# EasyEDA Pro project 小张FOC-STM32G431CBU6.epro, schematic Schematic1_1
Board Name: 主驱一体; Create Date: 2024-09-16; Page Name: P1; Project Name: 小张FOC-STM32G431CBU6; Schematic Name: Schematic1; Update Date: 2024-10-22; Company: 嘉立创EDA; Page Size: A3; Version: V1.0
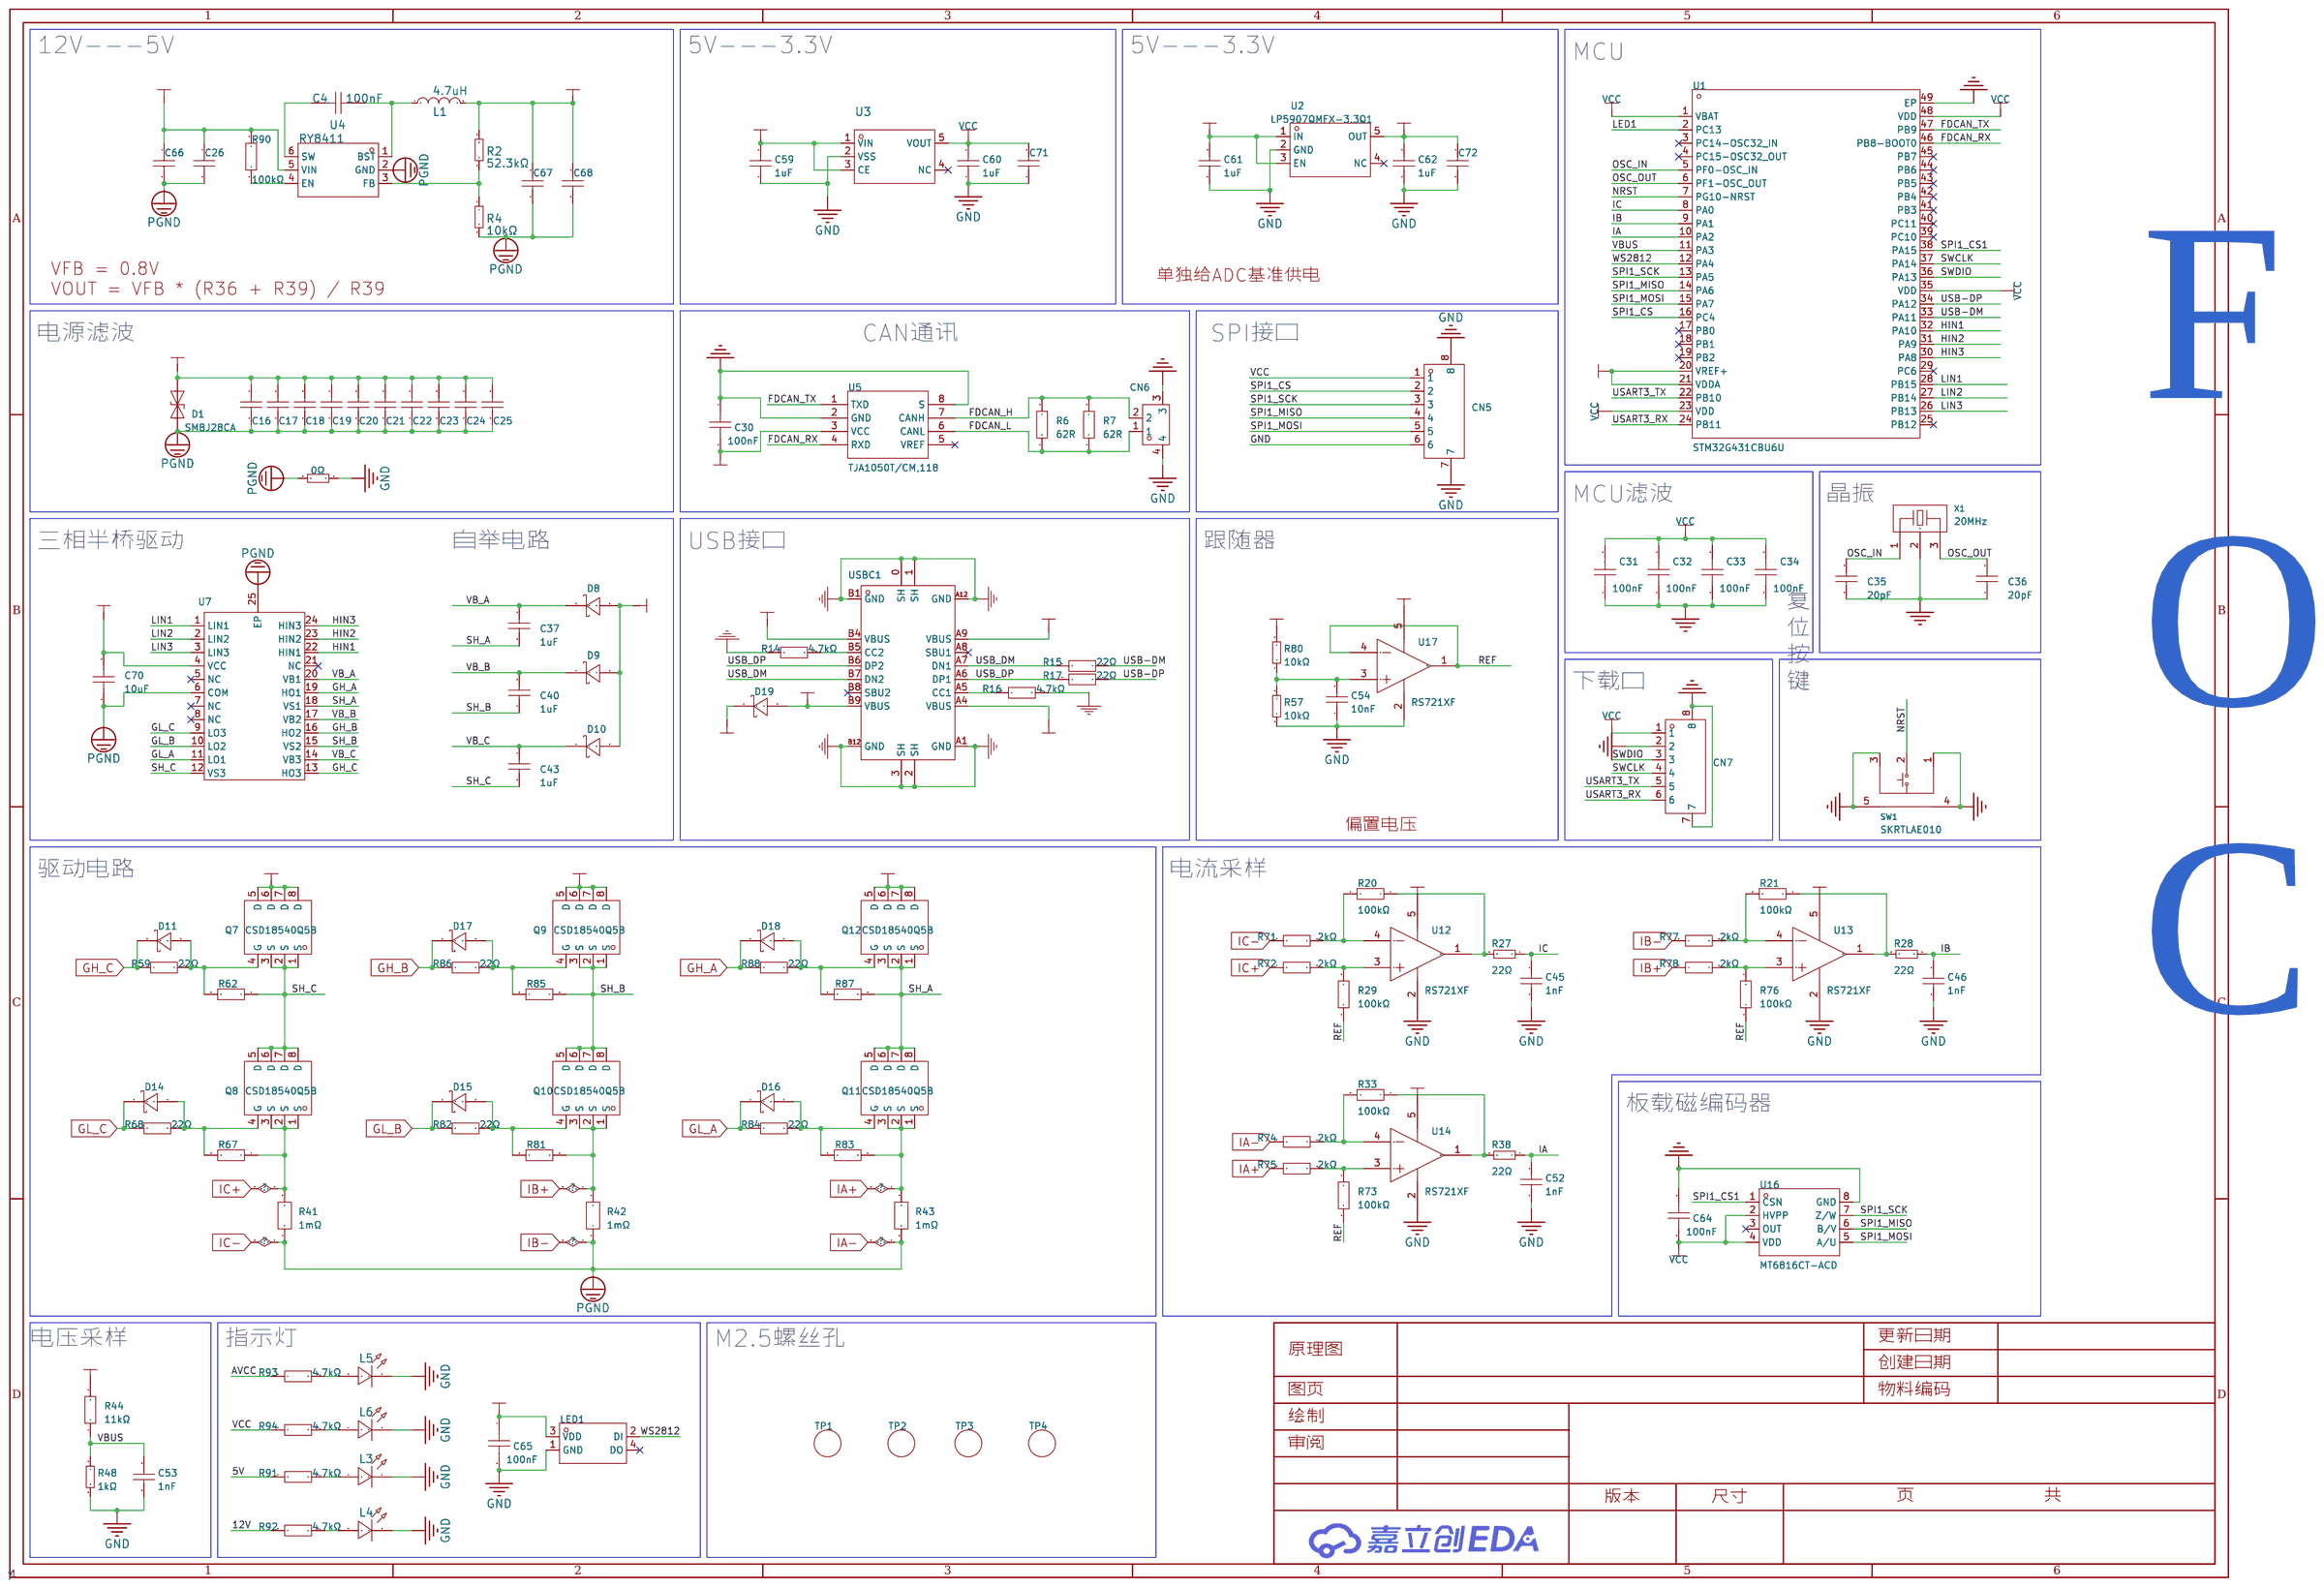
[diagram p2: schematic sheet]

## Parts
C4  100nF  [C0603_SMALL]
C16  10uF  [C1206_SMALL]
C17  10uF  [C1206_SMALL]
C18  10uF  [C1206_SMALL]
C19  10uF  [C1206_SMALL]
C20  10uF  [C1206_SMALL]
C21  10uF  [C1206_SMALL]
C22  10uF  [C1206_SMALL]
C23  10uF  [C1206_SMALL]
C24  10uF  [C1206_SMALL]
C25  10uF  [C1206_SMALL]
C26  100nF  [C0603_SMALL]
C30  100nF  [C0603_SMALL]
C31  100nF  [C0603_SMALL]
C32  100nF  [C0603_SMALL]
C33  100nF  [C0603_SMALL]
C34  100nF  [C0603_SMALL]
C35  20pF  [C0603_SMALL]
C36  20pF  [C0603_SMALL]
C37  1uF  [C0603_SMALL]
C40  1uF  [C0603_SMALL]
C43  1uF  [C0603_SMALL]
C45  1nF  [C0603_SMALL]
C46  1nF  [C0603_SMALL]
C52  1nF  [C0603_SMALL]
C53  1nF  [C0603_SMALL]
C54  10nF  [C0603_SMALL]
C59  1uF  [C0603_SMALL]
C60  1uF  [C0603_SMALL]
C61  1uF  [C0603_SMALL]
C62  1uF  [C0603_SMALL]
C64  100nF  [C0603_SMALL]
C65  100nF  [C0603_SMALL]
C66  10uF  [C1206_SMALL]
C67  10uF  [C1206_SMALL]
C68  100nF  [C0603_SMALL]
C70  10uF  [C0805_SMALL]
C71  100nF  [C0603_SMALL]
C72  100nF  [C0603_SMALL]
CN5  WAFER-GH1.25-6PWB  [CONN-SMD_6P-P1.25_XUNPU_WAFER-GH1.25-6PWB]
CN6  X1251WRS-02HF-LPSW  [CONN-SMD_2P-P1.25_X1251WRS-02HF-LPSW]
CN7  WAFER-GH1.25-6PWB  [CONN-SMD_6P-P1.25_XUNPU_WAFER-GH1.25-6PWB]
D1  SMBJ28CA  [SMB_L4.6-W3.6-LS5.3-BI]
D8  B16WS  [SOD-323_L1.8-W1.3-LS2.5-RD]
D9  B16WS  [SOD-323_L1.8-W1.3-LS2.5-RD]
D10  B16WS  [SOD-323_L1.8-W1.3-LS2.5-RD]
D11  B16WS  [SOD-323_L1.8-W1.3-LS2.5-RD]
D14  B16WS  [SOD-323_L1.8-W1.3-LS2.5-RD]
D15  B16WS  [SOD-323_L1.8-W1.3-LS2.5-RD]
D16  B16WS  [SOD-323_L1.8-W1.3-LS2.5-RD]
D17  B16WS  [SOD-323_L1.8-W1.3-LS2.5-RD]
D18  B16WS  [SOD-323_L1.8-W1.3-LS2.5-RD]
D19  B16WS  [SOD-323_L1.8-W1.3-LS2.5-RD]
L1  4.7uH  [IND-SMD_L2.5-W2.0]
L3  NCD0603R1  [LED0603_S]
L4  NCD0603R1  [LED0603_S]
L5  NCD0603R1  [LED0603_S]
L6  NCD0603R1  [LED0603_S]
LED1  XL-3528RGBW-WS2812B  [LED-SMD_4P-L3.5-W2.8-BR-1]
Q7  CSD18540Q5B  [VSON-CLIP-8_L5.0-W6.0-P1.27-BL]
Q8  CSD18540Q5B  [VSON-CLIP-8_L5.0-W6.0-P1.27-BL]
Q9  CSD18540Q5B  [VSON-CLIP-8_L5.0-W6.0-P1.27-BL]
Q10  CSD18540Q5B  [VSON-CLIP-8_L5.0-W6.0-P1.27-BL]
Q11  CSD18540Q5B  [VSON-CLIP-8_L5.0-W6.0-P1.27-BL]
Q12  CSD18540Q5B  [VSON-CLIP-8_L5.0-W6.0-P1.27-BL]
R2  52.3kΩ  [R0603_SMALL]
R4  10kΩ  [R0603_SMALL]
R6  62R  [R0603_SMALL]
R7  62R  [R0603_SMALL]
R11  0Ω  [R0603_SMALL]
R14  4.7kΩ  [R0603_SMALL]
R15  22Ω  [R0603_SMALL]
R16  4.7kΩ  [R0603_SMALL]
R17  22Ω  [R0603_SMALL]
R20  100kΩ  [R0603_SMALL]
R21  100kΩ  [R0603_SMALL]
R27  22Ω  [R0603_SMALL]
R28  22Ω  [R0603_SMALL]
R29  100kΩ  [R0603_SMALL]
R33  100kΩ  [R0603_SMALL]
R38  22Ω  [R0603_SMALL]
R41  1mΩ  [RES-SMD_L6.4-W3.2_LR2512D-3W-1MR]
R42  1mΩ  [RES-SMD_L6.4-W3.2_LR2512D-3W-1MR]
R43  1mΩ  [RES-SMD_L6.4-W3.2_LR2512D-3W-1MR]
R44  11kΩ  [R0603_SMALL]
R48  1kΩ  [R0603_SMALL]
R57  10kΩ  [R0603_SMALL]
R59  22Ω  [R0603_SMALL]
R62  10kΩ  [R0603_SMALL]
R67  10kΩ  [R0603_SMALL]
R68  22Ω  [R0603_SMALL]
R71  2kΩ  [R0603_SMALL]
R72  2kΩ  [R0603_SMALL]
R73  100kΩ  [R0603_SMALL]
R74  2kΩ  [R0603_SMALL]
R75  2kΩ  [R0603_SMALL]
R76  100kΩ  [R0603_SMALL]
R77  2kΩ  [R0603_SMALL]
R78  2kΩ  [R0603_SMALL]
R80  10kΩ  [R0603_SMALL]
R81  10kΩ  [R0603_SMALL]
R82  22Ω  [R0603_SMALL]
R83  10kΩ  [R0603_SMALL]
R84  22Ω  [R0603_SMALL]
R85  10kΩ  [R0603_SMALL]
R86  22Ω  [R0603_SMALL]
R87  10kΩ  [R0603_SMALL]
R88  22Ω  [R0603_SMALL]
R90  100kΩ  [R0603_SMALL]
R91  4.7kΩ  [R0603_SMALL]
R92  4.7kΩ  [R0603_SMALL]
R93  4.7kΩ  [R0603_SMALL]
R94  4.7kΩ  [R0603_SMALL]
SW1  SKRTLAE010  [KEY-SMD_SKRTLAE010]
TP1  -  [M2.5螺丝孔]
TP2  -  [M2.5螺丝孔]
TP3  -  [M2.5螺丝孔]
TP4  -  [M2.5螺丝孔]
U1  STM32G431CBU6U  [UFQFPN-48_L7.0-W7.0-P0.50-BL-EP5.6]
U2  LP5907QMFX-3.3Q1  [SOT-23-5_L3.0-W1.7-P0.95-LS2.8-BR]
U3  XC6210B332MR  [SOT-23-5_L3.0-W1.7-P0.95-LS2.8-BR]
U4  RY8411  [SOT-23-6_L2.9-W1.6-P0.95-LS2.8-BR]
U5  TJA1050T/CM,118  [SOIC-8_L5.0-W4.0-P1.27-LS6.0-BL]
U7  FD6288Q  [QFN-24_L4.0-W4.0-P0.50-BL-EP2.6]
U12  RS721XF  [TSOT-23-5_L2.9-W1.6-P0.95-LS2.8-BL]
U13  RS721XF  [TSOT-23-5_L2.9-W1.6-P0.95-LS2.8-BL]
U14  RS721XF  [TSOT-23-5_L2.9-W1.6-P0.95-LS2.8-BL]
U16  MT6816CT-ACD  [SOP-8_L5.0-W4.0-P1.27-LS6.0-BL]
U17  RS721XF  [TSOT-23-5_L2.9-W1.6-P0.95-LS2.8-BL]
USBC1  TYPE-C-31-M-12  [USB-C_SMD-TYPE-C-31-M-12]
X1  20MHz  [OSC-SMD_3P-L3.2-W1.3-P1.2-L]

## Library data of the parts
C4 = CC0603KRX7R9BB104: 容值:100nF;精度:±10%;额定电压:50V;材质(温度系数):X7R;; LCSC Part Name: 100nF ±10% 50V; Supplier Part: C14663; Manufacturer: YAGEO(国巨); Supplier Footprint: 0603; JLCPCB Part Class: 基础库; Datasheet: https://atta.szlcsc.com/upload/public/pdf/source/20180910/C282072_33301C7F631E79921B82A8DAC6BCC5B3.pdf; Supplier: LCSC; Tolerance: ±10%; Voltage Rated: 50V; Temperature Coefficient: X7R; Check: true
C16-C25 C66 C67 = CL31A106KBHNNNE: 容值:10uF;精度:±10%;额定电压:50V;材质(温度系数):X5R;; LCSC Part Name: 10uF ±10% 50V; Supplier Part: C13585; Manufacturer: SAMSUNG(三星); Supplier Footprint: 1206; JLCPCB Part Class: Basic Part; Datasheet: https://atta.szlcsc.com/upload/public/pdf/source/20160218/1457707763339.pdf; Supplier: LCSC; Tolerance: ±10%; Voltage Rated: 50V; Temperature Coefficient: X5R; Pin Type: IN; 值: 10UF; Check: true
C26 C68 C71 C72 = 0603B104K500NT: 容值:100nF;精度:±10%;额定电压:50V;材质(温度系数):X7R;; LCSC Part Name: 100nF ±10% 50V; Supplier Part: C30926; Manufacturer: FH(风华); Supplier Footprint: 0603; JLCPCB Part Class: Extended Part; Datasheet: https://atta.szlcsc.com/upload/public/pdf/source/20200305/C486355_26A10D38EF8C2A5C37091D0039909270.pdf; Supplier: LCSC; Tolerance: ±10%; Voltage Rated: 50V; Temperature Coefficient: X7R; Pin Type: IN; Check: true
C30-C34 C64 C65 = 0603B104K500NT: 容值:100nF;精度:±10%;额定电压:50V;材质(温度系数):X7R;; LCSC Part Name: 100nF ±10% 50V; Supplier Part: C30926; Manufacturer: FH(风华); Supplier Footprint: 0603; JLCPCB Part Class: Extended Part; Datasheet: https://atta.szlcsc.com/upload/public/pdf/source/20200305/C486355_26A10D38EF8C2A5C37091D0039909270.pdf; Supplier: LCSC; Tolerance: ±10%; Voltage Rated: 50V; Temperature Coefficient: X7R
C35 C36 = 20pF: LCSC Part Name: 20pF±5%50V; Supplier Part: C1648; Manufacturer: SAMSUNG(三星); Manufacturer Part: CL10C200JB8NNNC; Supplier Footprint: 0603; JLCPCB Part Class: 基础库; Datasheet: https://atta.szlcsc.com/upload/public/pdf/source/20160103/1457707686863.pdf; Supplier: LCSC; Tolerance: ±5%; Voltage Rated: 50V; Temperature Coefficient: C0G; Origin Footprint 2: C0603; Origin Footprint 1: CL10C200JB8NNNC
C37 C40 C43 = C0603_S: Pin Type: IN; Supplier Part: C1604; Check: true
C45 C46 C52 C53 = 0603B102K500NT: 容值:1nF;精度:±10%;额定电压:50V;材质(温度系数):X7R;; LCSC Part Name: 1nF ±10% 50V; Supplier Part: C44369; Manufacturer: FH(风华); Supplier Footprint: 0603; JLCPCB Part Class: Extended Part; Datasheet: https://atta.szlcsc.com/upload/public/pdf/source/20200305/C486355_26A10D38EF8C2A5C37091D0039909270.pdf; Supplier: LCSC; Tolerance: ±10%; Voltage Rated: 50V; Temperature Coefficient: X7R; Pin Type: IN; Check: true
C54 = 0603B103K500NT: 容值:10nF;精度:±10%;额定电压:50V;材质(温度系数):X7R;; LCSC Part Name: 10nF ±10% 50V; Supplier Part: C57112; Manufacturer: FH(风华); Supplier Footprint: 0603; JLCPCB Part Class: 基础库; Datasheet: https://atta.szlcsc.com/upload/public/pdf/source/20200305/C486355_26A10D38EF8C2A5C37091D0039909270.pdf; Supplier: LCSC; Tolerance: ±10%; Voltage Rated: 50V; Temperature Coefficient: X7R; Pin Type: IN; Check: true
C59-C62 = CL10A106MA8NRNC: 容值:10uF;精度:±20%;额定电压:25V;材质(温度系数):X5R;; LCSC Part Name: 10uF ±20% 25V; Supplier Part: C96446; Manufacturer: SAMSUNG(三星); Supplier Footprint: 0603; JLCPCB Part Class: 基础库; Datasheet: https://atta.szlcsc.com/upload/public/pdf/source/20160218/1457707763339.pdf; Supplier: LCSC; Tolerance: ±20%; Voltage Rated: 25V; Temperature Coefficient: X5R; Pin Type: IN; Check: true
C70 = CL21A106KAYNNNE_C15850: 容值:10uF;精度:±10%;额定电压:25V;材质(温度系数):X5R;; LCSC Part Name: 10uF ±10% 25V; Supplier Part: C15850; Manufacturer: SAMSUNG(三星); Manufacturer Part: CL21A106KAYNNNE; Supplier Footprint: 0805; JLCPCB Part Class: Basic Part; Datasheet: https://atta.szlcsc.com/upload/public/pdf/source/20160103/1457707679302.pdf; Supplier: LCSC; Tolerance: ±10%; Voltage Rated: 25V; Temperature Coefficient: X5R
CN5 CN7 = WAFER-GH1.25-6PWB: 参考系列:GH;间距:1.25mm;插针结构:1x6P;排数:1;每排PIN数:6;公母:公型插针;安装方式:卧贴;额定电流:1A;工作温度范围:-25~+85;; LCSC Part Name: GH1.25mm6P卧贴带扣带扣; Supplier Part: C3029381; Manufacturer: XUNPU(讯普); Supplier Footprint: SMD,P=1.25mm; JLCPCB Part Class: ExtendedPart; Datasheet: https://atta.szlcsc.com/upload/public/pdf/source/20220527/CB8773BFB0913C3B8ABD62CB38BA101A.pdf; Supplier: LCSC; Reference Series: GH; Pitch: 1.25mm; Pins Structure: 1x6P; Number of Rows: 1; Number of PINs Per Row: 6; Gender: 公型插针; Mounting Style: 卧贴; Current Rating (Max): 1A; Operating Temperature Range: -25~+85; Check: true
CN6 = X1251WRS-02HF-LPSW: 插针结构:1x2P;间距:1.25mm;安装方式:卧贴;参考系列:GH;总PIN数:2P;排数:1;每排PIN数:2;行距:-;额定电流:1A;触头材质:黄铜;触头镀层:锡;工作温度范围:-;; LCSC Part Name: 1x2P 间距:1.25mm 卧贴 系列:GH; Supplier Part: C388707; Manufacturer: XKB Connection(中国星坤); Supplier Footprint: SMD,P=1.25mm,卧贴; JLCPCB Part Class: 扩展库; Datasheet: https://atta.szlcsc.com/upload/public/pdf/source/20211011/E2F7306AE87519079AD4EC816349A567.pdf; Supplier: LCSC; Pins Structure: 1x2P; Pitch: 1.25mm; Mounting Style: 卧贴; Reference Series: GH; Number of Pins: 2P; Number of Rows: 1; Number of PINs Per Row: 2; Current Rating (Max): 1A; Contact Material: 黄铜; Contact Plating: 锡
D1 = SMBJ28CA: 反向截止电压(Vrwm):28V;最大钳位电压:45.4V;峰值脉冲电流(Ipp)@10/1000us:13.2A;击穿电压:31.1V;; Supplier Part: C356756; Manufacturer: JJW(捷捷微); Supplier Footprint: SMB(DO-214AA); JLCPCB Part Class: 扩展库; Datasheet: https://atta.szlcsc.com/upload/public/pdf/source/20190118/C364661_581AFCFF6ECC065E7F89B606E0837F4E.pdf; Supplier: LCSC; Reverse Stand-Off Voltage (Vrwm): 28V; Maximum Clamping Voltage: 45.4V; Peak Pulse Current (Ipp)@10/1000us: 13.2A; Breakdown Voltage: 31.1V; Reverse Leakage Current (Ir): 1uA; Type: TVS
D8-D10 = B16WS_C364278: 直流反向耐压(Vr):40V;平均整流电流(Io):1A;正向压降(Vf):650mV@1A;; Supplier Part: C364278; Manufacturer: MDD; Supplier Footprint: SOD-323; JLCPCB Part Class: Extended Part; Datasheet: https://atta.szlcsc.com/upload/public/pdf/source/20190125/C364278_08C9E980565605CB111C36D3361AA1D7.pdf; Supplier: LCSC; Reverse Voltage (Vr): 40V; Average Rectified Current (Io): 1A; Forward Voltage (Vf@If): 650mV@1A; Check: true
D11 D14-D19 = B16WS_C364278: 直流反向耐压(Vr):60V;平均整流电流(Io):1A;正向压降(Vf):700mV@1A;; Supplier Part: C364278; Manufacturer: MDD; Supplier Footprint: SOD-323; JLCPCB Part Class: Extended Part; Datasheet: https://atta.szlcsc.com/upload/public/pdf/source/20190125/C364278_08C9E980565605CB111C36D3361AA1D7.pdf; Supplier: LCSC; Reverse Voltage (Vr): 60V; Average Rectified Current (Io): 1A; Forward Voltage (Vf@If): 700mV@1A; Check: true
L1 = MPIH252010-4R7M-LF: 电感值:4.7uH;精度:±20%;额定电流:1A;; LCSC Part Name: 4.7uH ±20% 1A 275mΩ; Supplier Part: C490449; Manufacturer: microgate(麦捷科技); Supplier Footprint: SMD; JLCPCB Part Class: Extended Part; Datasheet: https://atta.szlcsc.com/upload/public/pdf/source/20200707/C490443_2060EC88E48E101AE91DC68C352BCAF4.pdf; Supplier: LCSC; Tolerance: ±20%; Rated Current: 1A; DC Resistance (DCR): 275mΩ; Check: true
L3-L6 = NCD0603R1_C84263: 发光颜色:红色;功率:65mW;透镜颜色:无色透明;主波长:615nm~630nm;发光强度:80mcd~220mcd;发光角度:130°;工作温度:-30℃~+85℃;; LCSC Part Name: 红灯 0603红灯   正贴; Supplier Part: C84263; Manufacturer: 国星光电; Supplier Footprint: 0603; JLCPCB Part Class: Extended Part; Datasheet: https://atta.szlcsc.com/upload/public/pdf/source/20200820/C84263_DABC6A75E58F576973B407FDBA283D60.pdf; Supplier: LCSC; Emitted Color: 红色; Forward Voltage (VF): 1.6V~2.6V; Forward Current: 20mA; Power Dissipation: 65mW; Lens Color: 无色透明; Dominant Wavelength: 615nm~630nm; Luminous Intensity: 80mcd~220mcd; Viewing Angle: 130°; Operating Temperature: -30℃~+85℃; Check: true
LED1 = XL-3528RGBW-WS2812B: 发光颜色:RGB三色;二极管配置:-;主波长:618nm~623nm；520nm~525nm；467nm~472nm;功率:50mW；50mW；45mW;安装方式:正贴;; LCSC Part Name: RGB三色 正贴 幻彩; Supplier Part: C2890364; Manufacturer: XINGLIGHT(成兴光); Supplier Footprint: SMD3528-4P; JLCPCB Part Class: 扩展库; Datasheet: https://atta.szlcsc.com/upload/public/pdf/source/20221102/50F456983F591359B0D81AA557777463.pdf; Supplier: LCSC; Emitted Color: RGB三色; Dominant Wavelength: 618nm~623nm；520nm~525nm；467nm~472nm; Peak Wavelength: 525nm；623nm；472nm; Forward Current: 20mA; Power Dissipation: 50mW；50mW；45mW; Viewing Angle: 120°; Mounting Sytle: 正贴; Operating Temperature: -25℃~+80℃; Check: true
Q7-Q12 = CSD18540Q5B: 类型:1个N沟道;漏源电压(Vdss):60V;连续漏极电流(Id):100A;功率(Pd):3.1W；195W;导通电阻(RDS(on)@Vgs,Id):2.2mΩ@10V,28A;阈值电压(Vgs(th)@Id):2.3V@250uA;; LCSC Part Name: 1个N沟道 耐压:60V 电流:100A; Supplier Part: C86513; Manufacturer: TI(德州仪器); Supplier Footprint: VSON-8(5x6); JLCPCB Part Class: 扩展库; Datasheet: https://www.ti.com/cn/lit/gpn/csd18540q5b; Supplier: LCSC; Type: 1个N沟道; Drain Source Voltage (Vdss): 60V; Continuous Drain Current (Id): 100A; Power Dissipation (Pd): 3.1W；195W; Drain Source On Resistance (RDS(on)@Vgs,Id): 2.2mΩ@10V,28A; Gate Threshold Voltage (Vgs(th)@Id): 2.3V@250uA; Total Gate Charge (Qg@Vgs): 53nC@10V; Input Capacitance (Ciss@Vds): 4.23nF@30V; Operating Temperature: -55℃~+150℃@(Tj)
R2 = 0603WAF6202T5E: 阻值:62kΩ;精度:±1%;功率:100mW;温度系数:±100ppm/℃;电阻类型:厚膜电阻;; LCSC Part Name: 62kΩ ±1% 100mW 厚膜电阻; Supplier Part: C23221; Manufacturer: UNI-ROYAL(厚声); Supplier Footprint: 0603; JLCPCB Part Class: Basic Part; Datasheet: https://atta.szlcsc.com/upload/public/pdf/source/20200306/C422600_1E6D84923E4A46A82E41ADD87F860B5C.pdf; Supplier: LCSC; Tolerance: ±1%; Power(Watts): 100mW; Overload Voltage (Max): 75V; Temperature Coefficient: ±100ppm/℃; Type: 厚膜电阻; Operating Temperature Range: -55℃~+155℃; Pin Type: IN; 美岩编码: A00010; 单价: 0.009222; Check: true
R4 = 0603WAF1202T5E: 阻值:12kΩ;精度:±1%;功率:100mW;温度系数:±100ppm/℃;电阻类型:厚膜电阻;; LCSC Part Name: 12kΩ ±1% 100mW 厚膜电阻; Supplier Part: C22790; Manufacturer: UNI-ROYAL(厚声); Supplier Footprint: 0603; JLCPCB Part Class: Basic Part; Datasheet: https://atta.szlcsc.com/upload/public/pdf/source/20200306/C422600_1E6D84923E4A46A82E41ADD87F860B5C.pdf; Supplier: LCSC; Tolerance: ±1%; Power(Watts): 100mW; Overload Voltage (Max): 75V; Temperature Coefficient: ±100ppm/℃; Type: 厚膜电阻; Operating Temperature Range: -55℃~+155℃; Pin Type: IN; 美岩编码: A00010; 单价: 0.009222; Check: true
R6 R7 = Res_0603: Supplier Footprint: 0603
R11 = RS-03000FT: 阻值:0Ω;精度:±1%;功率:100mW;; LCSC Part Name: 0Ω ±1% 100mW; Supplier Part: C136582; Manufacturer: FH(风华); Supplier Footprint: 0603; JLCPCB Part Class: Extended Part; Datasheet: https://atta.szlcsc.com/upload/public/pdf/source/20171106/C136582_15099532019501092527.pdf; Supplier: LCSC; Tolerance: ±1%; Power(Watts): 100mW; Overload Voltage (Max): 50V; Operating Temperature Range: -55℃~+155℃; Pin Type: IN; Check: true
R14 R16 R91-R94 = 0603WAF4701T5E: 电阻类型:厚膜电阻;阻值:4.7kΩ;精度:±1%;功率:100mW;最大工作电压:75V;温度系数:±100ppm/℃;; LCSC Part Name: 4.7kΩ ±1% 100mW 厚膜电阻; Supplier Part: C23162; Manufacturer: UNI-ROYAL(厚声); Supplier Footprint: 0603; JLCPCB Part Class: 基础库; Datasheet: https://atta.szlcsc.com/upload/public/pdf/source/20200306/C422600_1E6D84923E4A46A82E41ADD87F860B5C.pdf; Supplier: LCSC; Type: 厚膜电阻; Tolerance: ±1%; Power(Watts): 100mW; Overload Voltage (Max): 75V; Temperature Coefficient: ±100ppm/℃; Operating Temperature Range: -55℃~+155℃
R15 R17 = 0603WAF220JT5E: 电阻类型:厚膜电阻;阻值:22Ω;精度:±1%;功率:100mW;最大工作电压:75V;温度系数:±100ppm/℃;; LCSC Part Name: 22Ω ±1% 100mW 厚膜电阻; Supplier Part: C23345; Manufacturer: UNI-ROYAL(厚声); Supplier Footprint: 0603; JLCPCB Part Class: 基础库; Datasheet: https://atta.szlcsc.com/upload/public/pdf/source/20200306/C422600_1E6D84923E4A46A82E41ADD87F860B5C.pdf; Supplier: LCSC; Type: 厚膜电阻; Tolerance: ±1%; Power(Watts): 100mW; Overload Voltage (Max): 75V; Temperature Coefficient: ±100ppm/℃; Operating Temperature Range: -55℃~+155℃
R20 R21 R29 R33 R73 R76 R90 = 0603WAF1003T5E: 电阻类型:厚膜电阻;阻值:100kΩ;精度:±1%;功率:100mW;最大工作电压:75V;温度系数:±100ppm/℃;; LCSC Part Name: 100kΩ ±1% 100mW 厚膜电阻; Supplier Part: C25803; Manufacturer: UNI-ROYAL(厚声); Supplier Footprint: 0603; JLCPCB Part Class: 基础库; Datasheet: https://atta.szlcsc.com/upload/public/pdf/source/20200306/C422600_1E6D84923E4A46A82E41ADD87F860B5C.pdf; Supplier: LCSC; Type: 厚膜电阻; Tolerance: ±1%; Power(Watts): 100mW; Overload Voltage (Max): 75V; Temperature Coefficient: ±100ppm/℃; Operating Temperature Range: -55℃~+155℃
R27 R28 R38 R59 R68 R82 R84 R86 R88 = 0603WAF220JT5E: 电阻类型:厚膜电阻;阻值:22Ω;精度:±1%;功率:100mW;最大工作电压:75V;温度系数:±100ppm/℃;; LCSC Part Name: 22Ω ±1% 100mW 厚膜电阻; Supplier Part: C23345; Manufacturer: UNI-ROYAL(厚声); Supplier Footprint: 0603; JLCPCB Part Class: 基础库; Datasheet: https://atta.szlcsc.com/upload/public/pdf/source/20200306/C422600_1E6D84923E4A46A82E41ADD87F860B5C.pdf; Supplier: LCSC; Type: 厚膜电阻; Tolerance: ±1%; Power(Watts): 100mW; Overload Voltage (Max): 75V; Temperature Coefficient: ±100ppm/℃; Operating Temperature Range: -55℃~+155℃; Pin Type: IN; Check: true
R41-R43 = LR2512D-3W-1mR-1%: 电阻类型:采样电阻;阻值:1mΩ;精度:±1%;功率:3W;温度系数:25ppm/℃~+50ppm/℃;安装方式:贴片;; LCSC Part Name: 1mΩ ±1% 3W; Supplier Part: C500734; Manufacturer: Milliohm(毫欧); Supplier Footprint: 2512; JLCPCB Part Class: 扩展库; Datasheet: https://atta.szlcsc.com/upload/public/pdf/source/20211008/27BCB003066C6550DC06C87D8395239C.pdf; Supplier: LCSC; Type: 采样电阻; Tolerance: ±1%; Power(Watts): 3W; Temperature Coefficient: 25ppm/℃~+50ppm/℃; Mounting Sytle: 贴片
R44 = RC0603FR-0711KL: 电阻类型:厚膜电阻;阻值:11kΩ;精度:±1%;功率:100mW;最大工作电压:75V;温度系数:±100ppm/℃;; LCSC Part Name: 厚膜电阻 11kΩ ±1% 100mW; Supplier Part: C137801; Manufacturer: YAGEO(国巨); Supplier Footprint: 0603; JLCPCB Part Class: 扩展库; Datasheet: https://atta.szlcsc.com/upload/public/pdf/source/20180821/C275644_0D56F95EFF785E7D9A1FEF436B37DA78.pdf; Supplier: LCSC; Type: 厚膜电阻; Tolerance: ±1%; Power(Watts): 100mW; Overload Voltage (Max): 75V; Temperature Coefficient: ±100ppm/℃; Operating Temperature Range: -55℃~+155℃
R48 = RC0603FR-071KL: 电阻类型:厚膜电阻;阻值:1kΩ;精度:±1%;功率:100mW;; LCSC Part Name: 1kΩ ±1% 100mW; Supplier Part: C22548; Manufacturer: YAGEO(国巨); Supplier Footprint: 0603; JLCPCB Part Class: Extended Part; Datasheet: https://atta.szlcsc.com/upload/public/pdf/source/20180312/7BD3618A8B6324EA6280B0497A051AB7.pdf; Supplier: LCSC; Type: 厚膜电阻; Tolerance: ±1%; Power(Watts): 100mW; Temperature Coefficient: ±100ppm/℃; Overload Voltage (Max): 75V; Operating Temperature Range: -55℃~+155℃; Pin Type: IN; Check: true
R57 R62 R67 R80 R81 R83 R85 R87 = 0603WAF1002T5E: 阻值:10kΩ;精度:±1%;功率:100mW;温度系数:±100ppm/℃;电阻类型:厚膜电阻;; LCSC Part Name: 10kΩ ±1% 100mW 厚膜电阻; Supplier Part: C25804; Manufacturer: UNI-ROYAL(厚声); Supplier Footprint: 0603; JLCPCB Part Class: Basic Part; Datasheet: https://atta.szlcsc.com/upload/public/pdf/source/20200306/C422600_1E6D84923E4A46A82E41ADD87F860B5C.pdf; Supplier: LCSC; Tolerance: ±1%; Power(Watts): 100mW; Overload Voltage (Max): 75V; Temperature Coefficient: ±100ppm/℃; Type: 厚膜电阻; Operating Temperature Range: -55℃~+155℃; Pin Type: IN; Check: true
R71 R72 R74 R75 R77 R78 = 0603WAF3301T5E: 电阻类型:厚膜电阻;阻值:3.3kΩ;精度:±1%;功率:100mW;最大工作电压:75V;温度系数:±100ppm/℃;; LCSC Part Name: 3.3kΩ ±1% 100mW 厚膜电阻; Supplier Part: C22978; Manufacturer: UNI-ROYAL(厚声); Supplier Footprint: 0603; JLCPCB Part Class: 基础库; Datasheet: https://atta.szlcsc.com/upload/public/pdf/source/20200306/C422600_1E6D84923E4A46A82E41ADD87F860B5C.pdf; Supplier: LCSC; Type: 厚膜电阻; Tolerance: ±1%; Power(Watts): 100mW; Overload Voltage (Max): 75V; Temperature Coefficient: ±100ppm/℃; Operating Temperature Range: -55℃~+155℃
SW1 = SKRTLAE010: 电路结构:单刀单掷;按钮形状:圆形按钮;安装方式:卧贴;开关长度:4.5mm;开关宽度:3.4mm;开关高度:3.3mm;触点电流:50mA;额定电压(DC):12V;带灯:-;机械寿命:-;; LCSC Part Name: 4.5*3.4*3.3mm 卧贴 轻触开关; Supplier Part: C110293; Manufacturer: ALPSALPINE(阿尔卑斯阿尔派); Supplier Footprint: SMD; JLCPCB Part Class: 扩展库; Datasheet: https://atta.szlcsc.com/upload/public/pdf/source/20170428/1493376812809.pdf; Supplier: LCSC; Circuit: 单刀单掷; Actuator Style: 圆形按钮; Mounting Style: 卧贴; Switch Length: 4.5mm; Switch Width: 3.4mm; Switch Height: 3.3mm; Contact Current: 50mA; Voltage Rating (DC): 12V
TP1-TP4 = M2.5螺丝孔: _: 3
U1 = STM32G431CBU6U: CPU内核:CM4;程序存储容量:128KB;RAM总容量:32KB;GPIO端口数量:42;工作电压范围:1.71V~3.6V;CPU最大主频:170MHz;程序存储器类型:FLASH;; Supplier Part: C1341712; Manufacturer: ST(意法半导体); Supplier Footprint: UFQFPN-48(7x7); JLCPCB Part Class: 扩展库; Datasheet: https://atta.szlcsc.com/upload/public/pdf/source/20210607/F3CD0646E5D00AAFDE875C196C2D7333.pdf; Supplier: LCSC; CPU Core: CM4; Program Storage Size: 128KB; RAM Size: 32KB; GPIO Ports Number: 42; Operating Voltage Range: 1.71V~3.6V; CPU Maximum Speed: 170MHz; Program Memory Type: FLASH; Operating Temperature Range: -40℃~+85℃; ADC (Bit): 12bit; DAC (Bit): 12bit; Peripheral/Function: PWM；PWM; Internal Oscillator: 有
U2 = LP5907QMFX-3.3Q1: 输出类型:固定;输出极性:正;最大输入电压:5.5V;输出电压:3.3V;输出电流:250mA;电源纹波抑制比(PSRR):90dB;; Supplier Part: C130005; Manufacturer: TI(德州仪器); Supplier Footprint: SOT-23-5; JLCPCB Part Class: Extended Part; Datasheet: https://atta.szlcsc.com/upload/public/pdf/source/20170918/C130005_1505703244961975089.pdf; Supplier: LCSC; Output Type: 固定; Output Polarity: 正; Number of Outputs: 1; Maximum Input Voltage: 5.5V; Output Voltage: 3.3V; Dropout Voltage: 250mV@(250mA); Output Current: 250mA; Power Supply Rejection Ratio (PSRR): 90dB; Power Supply Rejection Ratio (PRSS): 90dB@(100Hz),60dB@(100kHz); Check: true
U3 = XC6210B332MR_C424705: 输出类型:固定;输出极性:正;最大输入电压:6V;输出电压:3.3V;输出电流:900mA;电源纹波抑制比(PSRR):60dB@(1kHz);; Supplier Part: C424705; Manufacturer: TOREX(特瑞仕); Supplier Footprint: SOT-25; JLCPCB Part Class: Extended Part; Datasheet: https://atta.szlcsc.com/upload/public/pdf/source/20190903/C424705_1DFB2113A9A78D399905DBF688657204.pdf; Supplier: LCSC; Output Type: 固定; Output Polarity: 正; Number of Outputs: 1; Maximum Input Voltage: 6V; Output Voltage: 3.3V; Dropout Voltage: 75mV@(100mA); Output Current: 900mA; Power Supply Rejection Ratio (PSRR): 60dB@(1kHz); Power Supply Rejection Ratio (PRSS): 90dB@(100Hz),60dB@(100kHz); Check: true
U4 = TD1466: Supplier: LCSC; Supplier Part: C185109; Manufacturer: JoulWatt Tech; Manufacturer Part: JW5026; JLCPCB Part Class: Extended Part; Check: true
U5 = TJA1050T/CM,118: 类型:收发器;; LCSC Part Name: 4.75V~5.25V; Supplier Part: C6952; Manufacturer: NXP(恩智浦); Supplier Footprint: SOP-8; JLCPCB Part Class: 扩展库; Datasheet: https://atta.szlcsc.com/upload/public/pdf/source/20140411/1457707042917.pdf; Supplier: LCSC; Type: 收发器; Supply Voltage: 4.75V~5.25V; Supply Current: 50mA
U7 = FD6288Q: Supplier Part: C328453; Manufacturer: Fortior Tech(峰岹); Supplier Footprint: QFN-24-EP(4x4); JLCPCB Part Class: 扩展库; Datasheet: https://atta.szlcsc.com/upload/public/pdf/source/20181108/C328453_785547738DB9FC0123219FC22539EFAD.pdf; Supplier: LCSC; Check: true
U12-U14 U17 = RS721XF: 放大器数:单路;增益带宽积(GBP):10MHz;输入偏置电流(Ib):1pA;压摆率(SR):7V/us;带宽(-3db):-;轨到轨:-;; LCSC Part Name: 低噪声运放RS721XF; Supplier Part: C237009; Manufacturer: RUNIC(润石); Supplier Footprint: SOT-23-5; JLCPCB Part Class: 扩展库; Supplier: LCSC; Number of Circuits: 单路; Gain Bandwidth Product(GBP): 10MHz; Current - Input Bias(Ib): 1pA; Slew Rate(SR): 7V/us; Output Current: 70mA; Operating Temperature: -40℃~+125℃
U16 = MT6816CT-ACD: AB=1024线，Z=4LSB，PWM=1KHz; LCSC Part Name: 零延迟磁角位置传感器IC; Supplier Part: C879560; Manufacturer: MagnTek(麦歌恩); Supplier Footprint: SOP-8; JLCPCB Part Class: 扩展库; Datasheet: https://atta.szlcsc.com/upload/public/pdf/source/20201027/C879560_21F27A21E71569DDEA564795613A647F.pdf; Supplier: LCSC
USBC1 = TYPE-C-31-M-12: 连接器类型:Type-C;标准:-;公母:母;端口数量:1;触点数量:16P;安装方式:-;额定电流 - 电源:5A;触头材质:-;触头镀层:-;工作温度范围:-;焊接温度(最大值):-;; LCSC Part Name: Type-C 母; Supplier Part: C165948; Manufacturer: 韩国韩荣; Supplier Footprint: SMD; JLCPCB Part Class: 扩展库; Datasheet: https://atta.szlcsc.com/upload/public/pdf/source/20220525/466408E853115E789EDB0DDC29077C05.pdf; Supplier: LCSC; Connector Type: Type-C; Gender: 母; Number of Ports: 1; Number of Contacts: 16P; Current Rating - Power (Max): 5A
X1 = CSTCE8M00G52-R0: 频率:8MHz;内置负载电容:10pF;谐振阻抗:40Ω;; LCSC Part Name: 8MHz ±0.5% 内置负载电容:10pF; Supplier Part: C22549; Manufacturer: muRata(村田); Supplier Footprint: SMD3213-3P; JLCPCB Part Class: 扩展库; Datasheet: https://atta.szlcsc.com/upload/public/pdf/source/20160120/1457707754326.pdf; Supplier: LCSC; Built-in Load Capacitance: 10pF; Resonant Impedance: 40Ω; Operating Temperature: -20℃~+80℃

## Nets
5V: C30.2 C59.2 C61.2 C65.1 C67.1 C68.1 D19.1 L1.2 LED1.3(VDD) R2.1 R91.1 U2.1(IN) U2.3(EN) U3.1(VIN) U3.3(CE) U5.3(VCC)
12V: C16.1 C17.1 C18.1 C19.1 C20.1 C21.1 C22.1 C23.1 C24.1 C25.1 C26.1 C66.1 C70.2 D1.1(K) D8.2 D9.2 D10.2 Q7.5(D) Q7.6(D) Q7.7(D) Q7.8(D) Q9.5(D) Q9.6(D) Q9.7(D) Q9.8(D) Q12.5(D) Q12.6(D) Q12.7(D) Q12.8(D) R44.2 R90.1 R92.1 U4.5(VIN) U7.4(VCC)
AVCC: C62.2 C72.1 R80.2 R93.1 U1.20(VREF+) U1.21(VDDA) U2.5(OUT) U12.5(v+) U13.5(v+) U14.5(v+) U17.5(v+)
GND: C30.1 C31.1 C32.1 C33.1 C34.1 C35.2 C36.1 C45.1 C46.1 C52.1 C53.1 C54.1 C59.1 C60.1 C61.1 C62.1 C64.1 C65.2 C71.2 C72.2 CN5.6 CN5.7 CN5.8 CN6.3 CN6.4 CN7.2 CN7.7 CN7.8 L3.2 L4.2 L5.2 L6.2 LED1.1(GND) R11.2 R14.1 R16.2 R48.2 R57.1 SW1.1 SW1.3 SW1.4 SW1.5 U1.49(EP) U2.2(GND) U3.2(VSS) U5.2(GND) U5.8(S) U12.2(v-) U13.2(v-) U14.2(v-) U16.8(GND) U17.2(v-) USBC1.0(SH) USBC1.1(SH) USBC1.2(SH) USBC1.3(SH) USBC1.A1(GND) USBC1.A12(GND) USBC1.B1(GND) USBC1.B12(GND) X1.2
PGND: C16.2 C17.2 C18.2 C19.2 C20.2 C21.2 C22.2 C23.2 C24.2 C25.2 C26.2 C66.2 C67.2 C68.2 C70.1 D1.2(A) R4.2 R11.1 R41.1 R42.1 R43.1 R71.1 R74.1 R77.1 U4.2(GND) U7.6(COM) U7.25(EP)
VBUS: C53.2 R44.1 R48.1 U1.11(PA3)
VCC: C31.2 C32.2 C33.2 C34.2 C60.2 C64.2 C71.1 CN5.1 CN7.1 R94.1 U1.1(VBAT) U1.23(VDD) U1.35(VDD) U1.48(VDD) U3.5(VOUT) U16.2(HVPP) U16.4(VDD)
FDCAN_H: CN6.2 R6.2 R7.2 U5.7(CANH)
FDCAN_L: CN6.1 R6.1 R7.1 U5.6(CANL)
FDCAN_RX: U1.46(PB8-BOOT0) U5.4(RXD)
FDCAN_TX: U1.47(PB9) U5.1(TXD)
GH_A: D18.1 R88.1 U7.19(HO1)
GH_B: D17.1 R86.1 U7.16(HO2)
GH_C: D11.1 R59.1 U7.13(HO3)
GL_A: D16.1 R84.1 U7.11(LO1)
GL_B: D15.1 R82.1 U7.10(LO2)
GL_C: D14.1 R68.1 U7.9(LO3)
HIN1: U1.32(PA10) U7.22(HIN1)
HIN2: U1.31(PA9) U7.23(HIN2)
HIN3: U1.30(PA8) U7.24(HIN3)
IA: C52.2 R38.1 U1.10(PA2)
IA+: Q11.1(S) Q11.2(S) Q11.3(S) R43.2 R75.1 R83.1
IB: C46.2 R28.1 U1.9(PA1)
IB+: Q10.1(S) Q10.2(S) Q10.3(S) R42.2 R78.1 R81.1
IC: C45.2 R27.1 U1.8(PA0)
IC+: Q8.1(S) Q8.2(S) Q8.3(S) R41.2 R67.1 R72.1
LED1: U1.2(PC13)
LIN1: U1.28(PB15) U7.1(LIN1)
LIN2: U1.27(PB14) U7.2(LIN2)
LIN3: U1.26(PB13) U7.3(LIN3)
NRST: SW1.2 U1.7(PG10-NRST)
OSC_IN: C35.1 U1.5(PF0-OSC_IN) X1.1
OSC_OUT: C36.2 U1.6(PF1-OSC_OUT) X1.3
REF: R29.2 R73.2 R76.2 U17.1(OUT) U17.4(-IN)
SH_A: C37.2 Q11.5(D) Q11.6(D) Q11.7(D) Q11.8(D) Q12.1(S) Q12.2(S) Q12.3(S) R87.1 U7.18(VS1)
SH_B: C40.2 Q9.1(S) Q9.2(S) Q9.3(S) Q10.5(D) Q10.6(D) Q10.7(D) Q10.8(D) R85.1 U7.15(VS2)
SH_C: C43.2 Q7.1(S) Q7.2(S) Q7.3(S) Q8.5(D) Q8.6(D) Q8.7(D) Q8.8(D) R62.1 U7.12(VS3)
SPI1_CS: CN5.2 U1.16(PC4)
SPI1_CS1: U1.38(PA15) U16.1(CSN)
SPI1_MISO: CN5.4 U1.14(PA6) U16.6(B/V)
SPI1_MOSI: CN5.5 U1.15(PA7) U16.5(A/U)
SPI1_SCK: CN5.3 U1.13(PA5) U16.7(Z/W)
SWCLK: CN7.4 U1.37(PA14)
SWDIO: CN7.3 U1.36(PA13)
USART3_RX: CN7.6 U1.24(PB11)
USART3_TX: CN7.5 U1.22(PB10)
USB-DM: R15.2 U1.33(PA11)
USB-DP: R17.2 U1.34(PA12)
USB-VBUS: D19.2 USBC1.A4(VBUS) USBC1.A9(VBUS) USBC1.B4(VBUS) USBC1.B9(VBUS)
USB_DM: R15.1 USBC1.A7(DN1) USBC1.B7(DN2)
USB_DP: R17.1 USBC1.A6(DP1) USBC1.B6(DP2)
VB_A: C37.1 D8.1 U7.20(VB1)
VB_B: C40.1 D9.1 U7.17(VB2)
VB_C: C43.1 D10.1 U7.14(VB3)
WS2812: LED1.2(DI) U1.12(PA4)
$1N2033: R14.2 USBC1.B5(CC2)
$1N2034: R16.1 USBC1.A5(CC1)
$1N2854: L3.1 R91.2
$1N2859: R2.2 R4.1 U4.3(FB)
$1N3499: L4.1 R92.2
$1N16031: R20.2 R71.2 U12.4(-IN)
$1N16145: R20.1 R27.2 U12.1(OUT)
$1N16800: R21.2 R77.2 U13.4(-IN)
$1N16806: R21.1 R28.2 U13.1(OUT)
$1N17179: R33.2 R74.2 U14.4(-IN)
$1N17185: R33.1 R38.2 U14.1(OUT)
$1N44641: R29.1 R72.2 U12.3(+IN)
$1N44863: R73.1 R75.2 U14.3(+IN)
$1N45012: R76.1 R78.2 U13.3(+IN)
$1N45449: C54.2 R57.2 R80.1 U17.3(+IN)
$1N49622: D11.2 Q7.4(G) R59.2 R62.2
$1N53821: D15.2 Q10.4(G) R81.2 R82.2
$1N53957: D16.2 Q11.4(G) R83.2 R84.2
$1N54089: D17.2 Q9.4(G) R85.2 R86.2
$1N54225: D18.2 Q12.4(G) R87.2 R88.2
$1N55157: R90.2 U4.4(EN)
$1N55174: C4.2 U4.6(SW)
$1N55187: C4.1 L1.1 U4.1(BST)
$1N55720: L5.1 R93.2
$1N55724: L6.1 R94.2
$1N81384: D14.2 Q8.4(G) R67.2 R68.2

Not connected (* = marked no-connect by the designer): LED1 4(DO)*; U1 3(PC14-OSC32_IN)* 4(PC15-OSC32_OUT)* 17(PB0)* 18(PB1)* 19(PB2)* 25(PB12)* 29(PC6)* 39(PC10)* 40(PC11)* 41(PB3)* 42(PB4)* 43(PB5)* 44(PB6)* 45(PB7)*; U2 4(NC)*; U3 4(NC)*; U5 5(VREF)*; U7 5(NC)* 7(NC)* 8(NC)* 21(NC)*; U16 3(OUT)*; USBC1 A8(SBU1)* B8(SBU2)*

## Notes on the sheet
- 12V---5V
- 5V---3.3V
- 5V---3.3V
- MCU
- F
  O
  C
- VFB = 0.8V
- 单独给ADC基准供电
- VOUT = VFB * (R36 + R39) / R39
- 电源滤波
- CAN通讯
- SPI接口
- MCU滤波
- 晶振
- 三相半桥驱动
- 自举电路
- USB接口
- 跟随器
- 下载口
- 复
  位
  按
  键
- 偏置电压
- 驱动电路
- 电流采样
- 板载磁编码器
- 电压采样
- 指示灯
- M2.5螺丝孔
